# Altium schematic sheet CAN - STM32F4.SchDoc
size A4
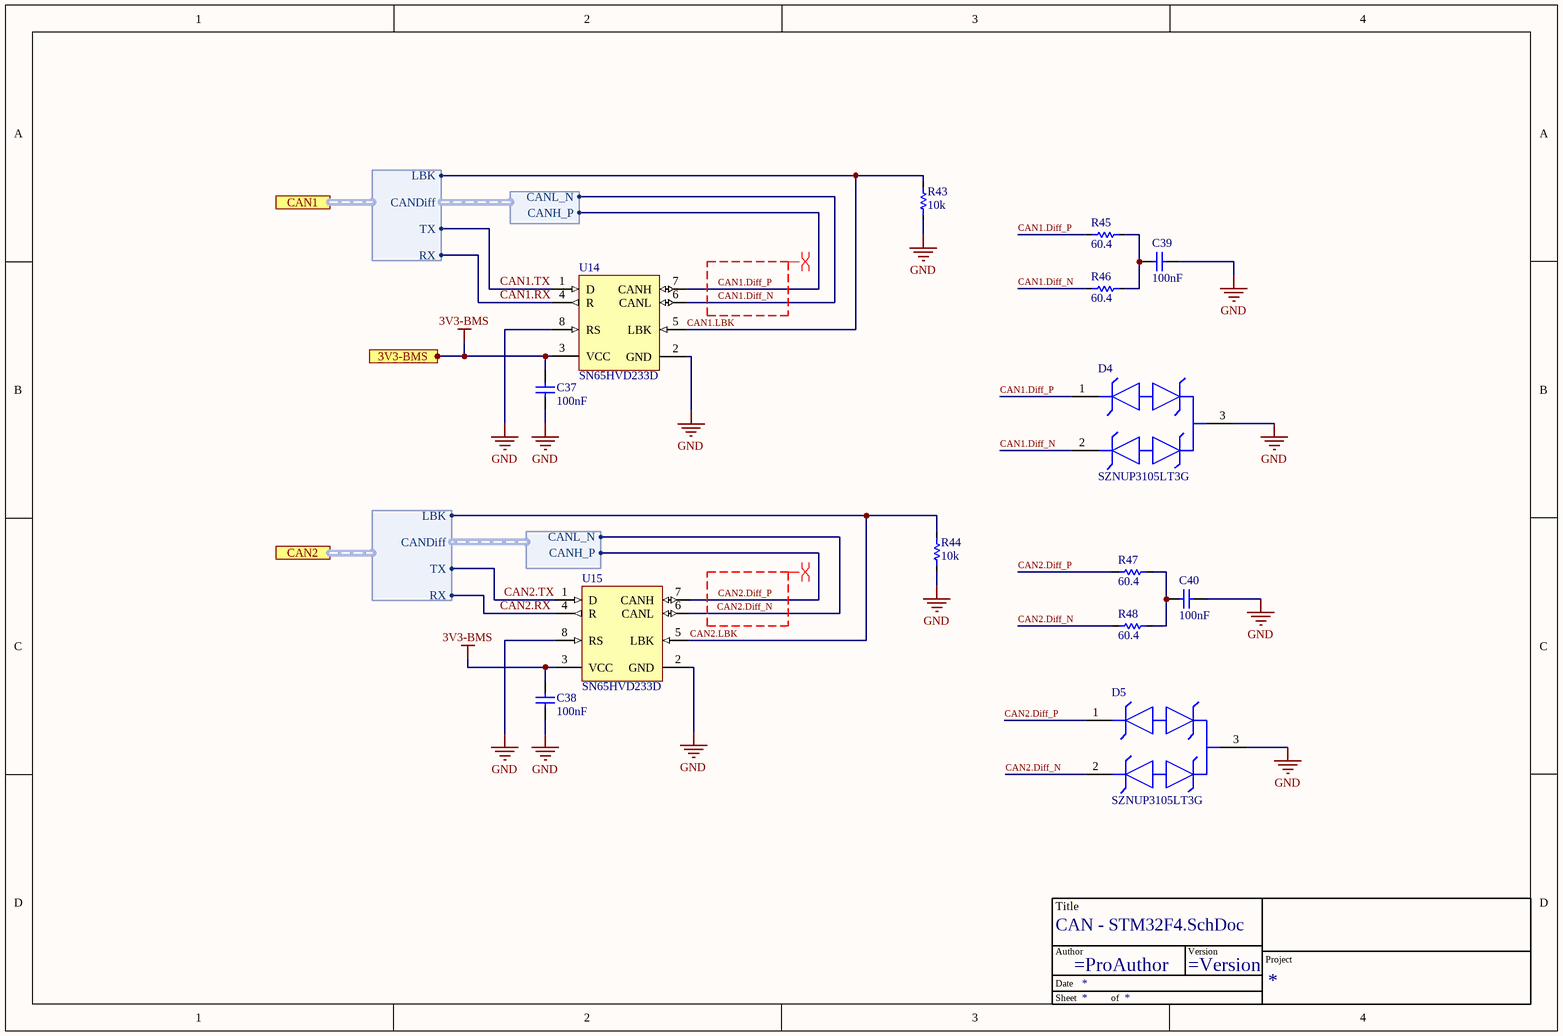
[diagram p0: CAN - STM32F4.SchDoc]

## Parts
*  TitleBlock  (value not drawn)  (graphical)
C37  value 100nF  [C_0603]  (hidden comment: C0603C104K3RAC7013)
C38  value 100nF  [C_0603]  (hidden comment: C0603C104K3RAC7013)
C39  value 100nF  [C_0603]  (hidden comment: C0603C104K3RAC7013)
C40  value 100nF  [C_0603]  (hidden comment: C0603C104K3RAC7013)
D4  SZNUP3105LT3G  [FP-318-08-MFG]
D5  SZNUP3105LT3G  [FP-318-08-MFG]
R43  value 10k  [R-0603]  (hidden comment: RC0603FR-1310KL)
R44  value 10k  [R-0603]  (hidden comment: RC0603FR-1310KL)
R45  value 60.4  [R-0603]  (hidden comment: CRCW080560R4FKEA)
R46  value 60.4  [R-0603]  (hidden comment: CRCW080560R4FKEA)
R47  value 60.4  [R-0603]  (hidden comment: CRCW080560R4FKEA)
R48  value 60.4  [R-0603]  (hidden comment: CRCW080560R4FKEA)
U14  SN65HVD233D  [D0008A_N]
U15  SN65HVD233D  [D0008A_N]

## Ports
3V3-BMS (in), CAN1 (harness CAN), CAN2 (harness CAN)

## Harnesses
CAN: LBK, CANDiff, TX, RX
CANDiff: CANL_N, CANH_P
CANDiff: CANH_P, CANL_N

## Nets
3V3-BMS: C37.2 C38.2 U14.3(VCC) U15.3(VCC) ; port 3V3-BMS
GND: C37.1 C38.1 C39.1 C40.1 D4.3 D5.3 R43.1 R44.1 U14.2(GND) U14.8(RS) U15.2(GND) U15.8(RS)
CAN1.Diff_N: D4.2 R46.1 U14.6(CANL) ; harness CANDiff.CANL_N
CAN1.Diff_P: D4.1 R45.1 U14.7(CANH) ; harness CANDiff.CANH_P
CAN1.LBK: R43.2 U14.5(LBK) ; port CAN1.LBK
CAN1.RX: U14.4(R) ; port CAN1.RX
CAN1.TX: U14.1(D) ; port CAN1.TX
CAN2.Diff_N: D5.2 R48.1 U15.6(CANL) ; harness CANDiff.CANL_N
CAN2.Diff_P: D5.1 R47.1 U15.7(CANH) ; harness CANDiff.CANH_P
CAN2.LBK: R44.2 U15.5(LBK) ; port CAN2.LBK
CAN2.RX: U15.4(R) ; port CAN2.RX
CAN2.TX: U15.1(D) ; port CAN2.TX
NetC39_2: C39.2 R45.2 R46.2
NetC40_2: C40.2 R47.2 R48.2

## Layout directives
differential pair; net class CAN_Diff; differential pair class CAN_Diff: CAN1.Diff_N, CAN1.Diff_P, CAN2.Diff_N, CAN2.Diff_P

## Notes on the sheet
- (in symbol TitleBlock) Title; Author; Version; Project; Date; Sheet; of

## Library data of the parts
C37-C40 = Capacitor: ComponentLink1Description: New link; ComponentLink1URL: *
D4 D5 = CMP-07200-000005-1: TVS DIODE 32V 66V SOT23-3; Manufacturer: ON Semiconductor; Max Junction Temp: +150°C; Standoff Height: 0.01mm; Peak Pulse Power: 350W; Breakdown Voltage: 35.6V; Automotive Grade: Grade 0; Number Of Channels: 2; Direction: Bidirectional; Peak Pulse Current: 8A; Height: 1.11mm; Mouser Description: 32V Dual Line CAN Bus Protector in SOT-23 AEC-Q 24 V CAN Bus Protector in SOT-23; Device Class L3: unset; Clamping Voltage: 66V; Manufacturer Part Number: SZNUP3105LT3G; ComponentLink2Description: Datasheet; Octopart: https://octopart.com/sznup3105lt3g-on+semiconductor-54318507; Temperature Range High: +150°C; Reverse Standoff Voltage: 32V; RoHS: TRUE; Package: 318-08; Device Class L2: TVS Diodes; Device Class L1: Circuit Protection; Temperature Range Low: -55°C; Lead Free: Yes; Temperature: -55°C to +150°C; ComponentLink2URL: https://www.onsemi.com/pub/Collateral/NUP3105L-D.PDF; Automotive: Yes; Footprint Url: https://www.onsemi.com/pub/Collateral/318-08.PDF; Digikey Description: TVS DIODE 32V 66V SOT23-3; Category: Diode
R43-R48 = Resistor
U14 U15 = CMP-0315-00036-2: 3.3V CAN Transceiver with Standby Mode, Loop-back, 6 mA, -40 to 125 degC, 8-pin SOIC (D), Green (RoHS & no Sb/Br); Manufacturer: Texas Instruments; Receivers Per Package: 1; Bus Fault Voltage(V): +/-30; Rating: Catalog; ICC(Max)(mA): 6; Supply Voltage(s)(V): 3.3; Transient Pulse Protection(V): -100 to 100; PackageVersion: revM, Jun-2011; PackageReference: D0008A; ComponentLink1Description: Datasheet; Isolated: No; Footprint: PCA82C250, excludes pin5; DatasheetVersion: SLLS557F; PackageDescription: 8-Pin Plastic Small Outline Integrated Circuit, 4.9 x 3.9 mm, Pitch 1.27 mm Pitch; Features: Loop Back; Low Power Mode: Standby; SubFamily: CAN; Drivers Per Package: 1; Eco-Plan: Green (RoHS & no Sb/Br); ComponentLink1URL: http://www.ti.com/general/docs/lit/getliterature.tsp?genericPartNumber=SN65HVD233&fileType=pdf; PartNumber: SN65HVD233D; Code_JEDEC: MS-012AA; Mounting Technology: Surface Mount